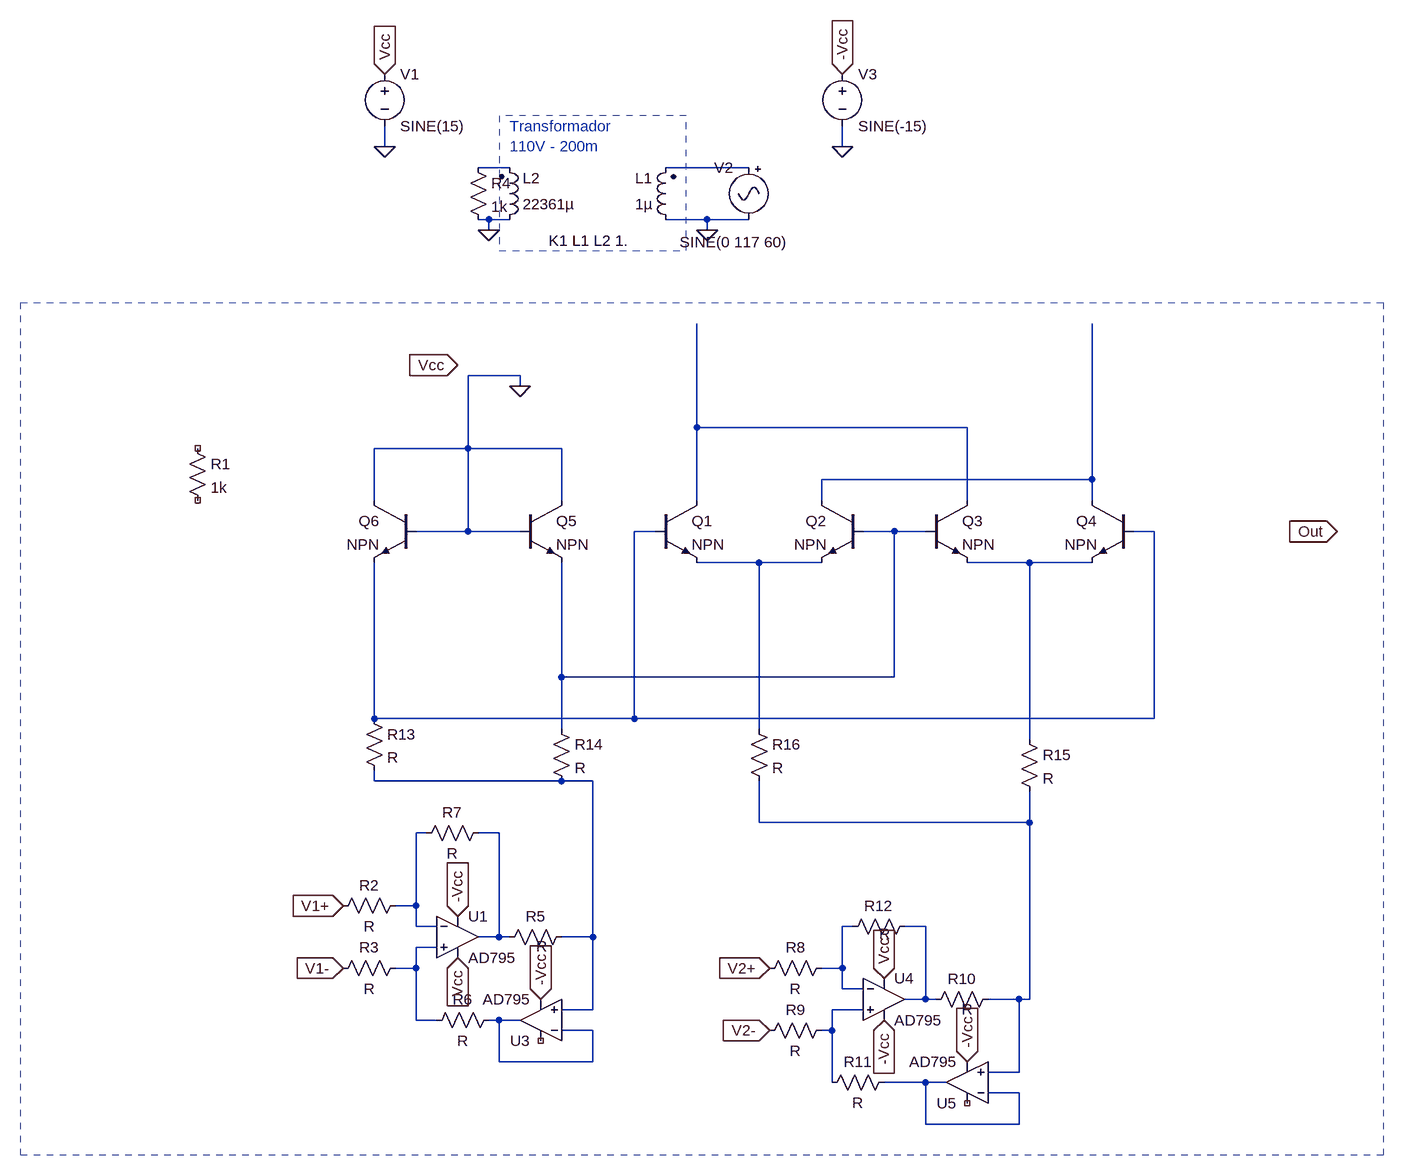
[diagram p0: schematic multiplicador analogico completo.asc]
multiplicador analogico completo.asc, the LTspice schematic file:
Version 4
SHEET 1 1284 908
WIRE -256 -688 -256 -720
WIRE 448 -688 448 -720
WIRE -64 -656 -112 -656
WIRE 304 -656 176 -656
WIRE -96 -576 -112 -576
WIRE -64 -576 -96 -576
WIRE 240 -576 176 -576
WIRE 304 -576 240 -576
WIRE -96 -560 -96 -576
WIRE 240 -560 240 -576
WIRE -48 -336 -128 -336
WIRE -48 -320 -48 -336
WIRE 224 -256 224 -416
WIRE 640 -256 224 -256
WIRE -128 -224 -128 -336
WIRE -128 -224 -272 -224
WIRE 16 -224 -128 -224
WIRE 832 -176 832 -416
WIRE 832 -176 416 -176
WIRE -272 -144 -272 -224
WIRE 16 -144 16 -224
WIRE 224 -144 224 -256
WIRE 416 -144 416 -176
WIRE 640 -144 640 -256
WIRE 832 -144 832 -176
WIRE -128 -96 -128 -224
WIRE -128 -96 -208 -96
WIRE -48 -96 -128 -96
WIRE 160 -96 128 -96
WIRE 528 -96 480 -96
WIRE 576 -96 528 -96
WIRE 928 -96 896 -96
WIRE 320 -48 224 -48
WIRE 416 -48 320 -48
WIRE 736 -48 640 -48
WIRE 832 -48 736 -48
WIRE 16 128 16 -48
WIRE 528 128 528 -96
WIRE 528 128 16 128
WIRE -272 192 -272 -48
WIRE 128 192 128 -96
WIRE 128 192 -272 192
WIRE 928 192 928 -96
WIRE 928 192 128 192
WIRE 16 208 16 128
WIRE 320 208 320 -48
WIRE 736 224 736 -48
WIRE -272 288 -272 272
WIRE 16 288 -272 288
WIRE 64 288 16 288
WIRE 320 352 320 288
WIRE 736 352 736 304
WIRE 736 352 320 352
WIRE -192 368 -208 368
WIRE -80 368 -112 368
WIRE -208 480 -208 368
WIRE -208 480 -240 480
WIRE -208 512 -208 480
WIRE -176 512 -208 512
WIRE 464 512 448 512
WIRE 576 512 544 512
WIRE -80 528 -80 368
WIRE -80 528 -112 528
WIRE -64 528 -80 528
WIRE 64 528 64 288
WIRE 64 528 16 528
WIRE -176 544 -208 544
WIRE -208 576 -208 544
WIRE -208 576 -240 576
WIRE 448 576 448 512
WIRE 448 576 416 576
WIRE 448 608 448 576
WIRE 480 608 448 608
WIRE 576 624 576 512
WIRE 576 624 544 624
WIRE 592 624 576 624
WIRE 720 624 672 624
WIRE 736 624 736 352
WIRE 736 624 720 624
WIRE 64 640 64 528
WIRE 64 640 16 640
WIRE 480 640 432 640
WIRE -208 656 -208 576
WIRE -176 656 -208 656
WIRE -80 656 -96 656
WIRE -48 656 -80 656
WIRE 64 672 16 672
WIRE 432 672 432 640
WIRE 432 672 416 672
WIRE -80 720 -80 656
WIRE 64 720 64 672
WIRE 64 720 -80 720
WIRE 720 736 720 624
WIRE 720 736 672 736
WIRE 432 752 432 672
WIRE 576 752 512 752
WIRE 608 752 576 752
WIRE 720 768 672 768
WIRE 576 816 576 752
WIRE 720 816 720 768
WIRE 720 816 576 816
FLAG 1136 -96 Out
IOPIN 1136 -96 Out
FLAG -144 -352 Vcc
IOPIN -144 -352 In
FLAG -256 -800 Vcc
IOPIN -256 -800 In
FLAG -256 -688 0
FLAG 240 -560 0
FLAG -96 -560 0
FLAG 448 -800 -Vcc
IOPIN 448 -800 In
FLAG 448 -688 0
FLAG -48 -320 0
FLAG -320 480 V1+
IOPIN -320 480 In
FLAG -320 576 V1-
IOPIN -320 576 In
FLAG 336 576 V2+
IOPIN 336 576 In
FLAG 336 672 V2-
IOPIN 336 672 In
FLAG -16 624 -Vcc
IOPIN -16 624 In
FLAG -144 496 -Vcc
IOPIN -144 496 In
FLAG 512 656 -Vcc
IOPIN 512 656 In
FLAG 640 720 -Vcc
IOPIN 640 720 In
FLAG -144 560 Vcc
IOPIN -144 560 In
FLAG 512 592 Vcc
IOPIN 512 592 In
SYMBOL npn 160 -144 R0
SYMATTR InstName Q1
SYMBOL npn 480 -144 M0
SYMATTR InstName Q2
SYMBOL res -560 -240 R0
SYMATTR InstName R1
SYMATTR Value 1k
SYMBOL voltage -256 -816 R0
WINDOW 123 0 0 Left 2
WINDOW 39 0 0 Left 2
SYMATTR InstName V1
SYMATTR Value SINE(15)
SYMBOL ind2 192 -560 R180
WINDOW 0 36 80 Left 2
WINDOW 3 36 40 Left 2
SYMATTR InstName L1
SYMATTR Value 1µ
SYMATTR SpiceLine Rser=100
SYMBOL ind2 -80 -560 M180
WINDOW 0 36 80 Left 2
WINDOW 3 36 40 Left 2
SYMATTR InstName L2
SYMATTR Value 22361µ
SYMATTR SpiceLine Rser=100
SYMBOL Misc\\signal 304 -672 M0
WINDOW 3 -60 131 Left 2
WINDOW 123 0 0 Left 2
WINDOW 39 0 0 Left 2
SYMATTR Value SINE(0 117 60)
SYMATTR InstName V2
SYMBOL res -128 -672 R0
SYMATTR InstName R4
SYMATTR Value 1k
SYMBOL voltage 448 -816 R0
WINDOW 123 0 0 Left 2
WINDOW 39 0 0 Left 2
SYMATTR InstName V3
SYMATTR Value SINE(-15)
SYMBOL npn 576 -144 R0
SYMATTR InstName Q3
SYMBOL npn 896 -144 M0
SYMATTR InstName Q4
SYMBOL npn -48 -144 R0
SYMATTR InstName Q5
SYMBOL npn -208 -144 M0
SYMATTR InstName Q6
SYMBOL Opamps\\AD795 -144 464 R0
SYMATTR InstName U1
SYMBOL res -224 464 R90
WINDOW 0 0 56 VBottom 2
WINDOW 3 32 56 VTop 2
SYMATTR InstName R2
SYMBOL res -224 560 R90
WINDOW 0 0 56 VBottom 2
WINDOW 3 32 56 VTop 2
SYMATTR InstName R3
SYMBOL Opamps\\AD795 -16 720 R180
SYMATTR InstName U3
SYMBOL res 32 512 R90
WINDOW 0 0 56 VBottom 2
WINDOW 3 15 46 VTop 2
SYMATTR InstName R5
SYMBOL res -80 640 R90
WINDOW 0 0 56 VBottom 2
WINDOW 3 32 56 VTop 2
SYMATTR InstName R6
SYMBOL res -96 352 R90
WINDOW 0 0 56 VBottom 2
WINDOW 3 32 56 VTop 2
SYMATTR InstName R7
SYMBOL Opamps\\AD795 512 560 R0
SYMATTR InstName U4
SYMBOL res 432 560 R90
WINDOW 0 0 56 VBottom 2
WINDOW 3 32 56 VTop 2
SYMATTR InstName R8
SYMBOL res 432 656 R90
WINDOW 0 0 56 VBottom 2
WINDOW 3 32 56 VTop 2
SYMATTR InstName R9
SYMBOL Opamps\\AD795 640 816 R180
SYMATTR InstName U5
SYMBOL res 688 608 R90
WINDOW 0 0 56 VBottom 2
WINDOW 3 16 48 VTop 2
SYMATTR InstName R10
SYMBOL res 528 736 R90
WINDOW 0 0 56 VBottom 2
WINDOW 3 32 56 VTop 2
SYMATTR InstName R11
SYMBOL res 560 496 R90
WINDOW 0 0 56 VBottom 2
WINDOW 3 12 47 VTop 2
SYMATTR InstName R12
SYMBOL res -288 176 R0
SYMATTR InstName R13
SYMBOL res 0 192 R0
SYMATTR InstName R14
SYMBOL res 720 208 R0
SYMATTR InstName R15
SYMBOL res 304 192 R0
SYMATTR InstName R16
TEXT 120 -544 Right 2 !K1 L1 L2 1.
TEXT -64 -720 Left 2 ;Transformador \n110V - 200m
LINE Normal 208 -528 208 -736 2
LINE Normal -80 -528 208 -528 2
LINE Normal -80 -736 -80 -528 2
LINE Normal 208 -736 -80 -736 2
RECTANGLE Normal 1280 864 -816 -448 2

The netlist it stands for:
* multiplicador analogico completo.asc
Q1 N003 N005 N007 0 NPN
Q2 N004 N006 N007 0 NPN
R1 NC_01 NC_02 1k
V1 Vcc 0 SINE(15)
L1 0 N002 1µ Rser=100
L2 0 N001 22361µ Rser=100
V2 N002 0 SINE(0 117 60)
R4 N001 0 1k
V3 -Vcc 0 SINE(-15)
Q3 N003 N006 N008 0 NPN
Q4 N004 N005 N008 0 NPN
Q5 0 0 N006 0 NPN
Q6 0 0 N005 0 NPN
XU1 N015 N011 -Vcc Vcc N012 AD795  ; pins In+ In- V+ V- OUT
R2 N011 V1+ R
R3 N015 V1- R
XU3 N009 N017 NC_03 -Vcc N017 AD795  ; pins In+ In- V+ V- OUT
R5 N009 N012 R
R6 N017 N015 R
R7 N012 N011 R
XU4 N016 N013 Vcc -Vcc N014 AD795  ; pins In+ In- V+ V- OUT
R8 N013 V2+ R
R9 N016 V2- R
XU5 N010 N018 NC_04 -Vcc N018 AD795  ; pins In+ In- V+ V- OUT
R10 N010 N014 R
R11 N018 N016 R
R12 N014 N013 R
R13 N005 N009 R
R14 N006 N009 R
R15 N008 N010 R
R16 N007 N010 R
.model NPN NPN
.model PNP PNP
.lib standard.bjt
K1 L1 L2 1.
* Transformador
* 110V - 200m
.lib ADI1.lib
.backanno
.end